# Altium schematic sheet BeagleBone_RF_Cape_Rev_A2_Host Inf.SchDoc: RF Adaptor Cape
size A4; Date: Not shown in title block; ApprovedBy: Not shown in title block; CheckedBy: Not shown in title block; Author: Not shown in title block; CompanyName: Not shown in title block; DrawnBy: Grant Smith; Engineer: Grant Smith; Organization: Texas Instruments; Address1: Not shown in title block; Address2: Not shown in title block; Address3: Not shown in title block; Address4: Not shown in title block; DocumentNumber: 2; Revision: 0.1; SheetNumber: 2; SheetTotal: 3; PRJ Title: RF Cape; CurrentTime: Not shown in title block; CurrentDate: Not shown in title block; Time: Not shown in title block; DocumentFullPathAndName: Not shown in title block; DocumentName: Not shown in title block; ModifiedDate: Not shown in title block; ImagePath: Not shown in title block; ProjectName: RF Cape for Beaglebone
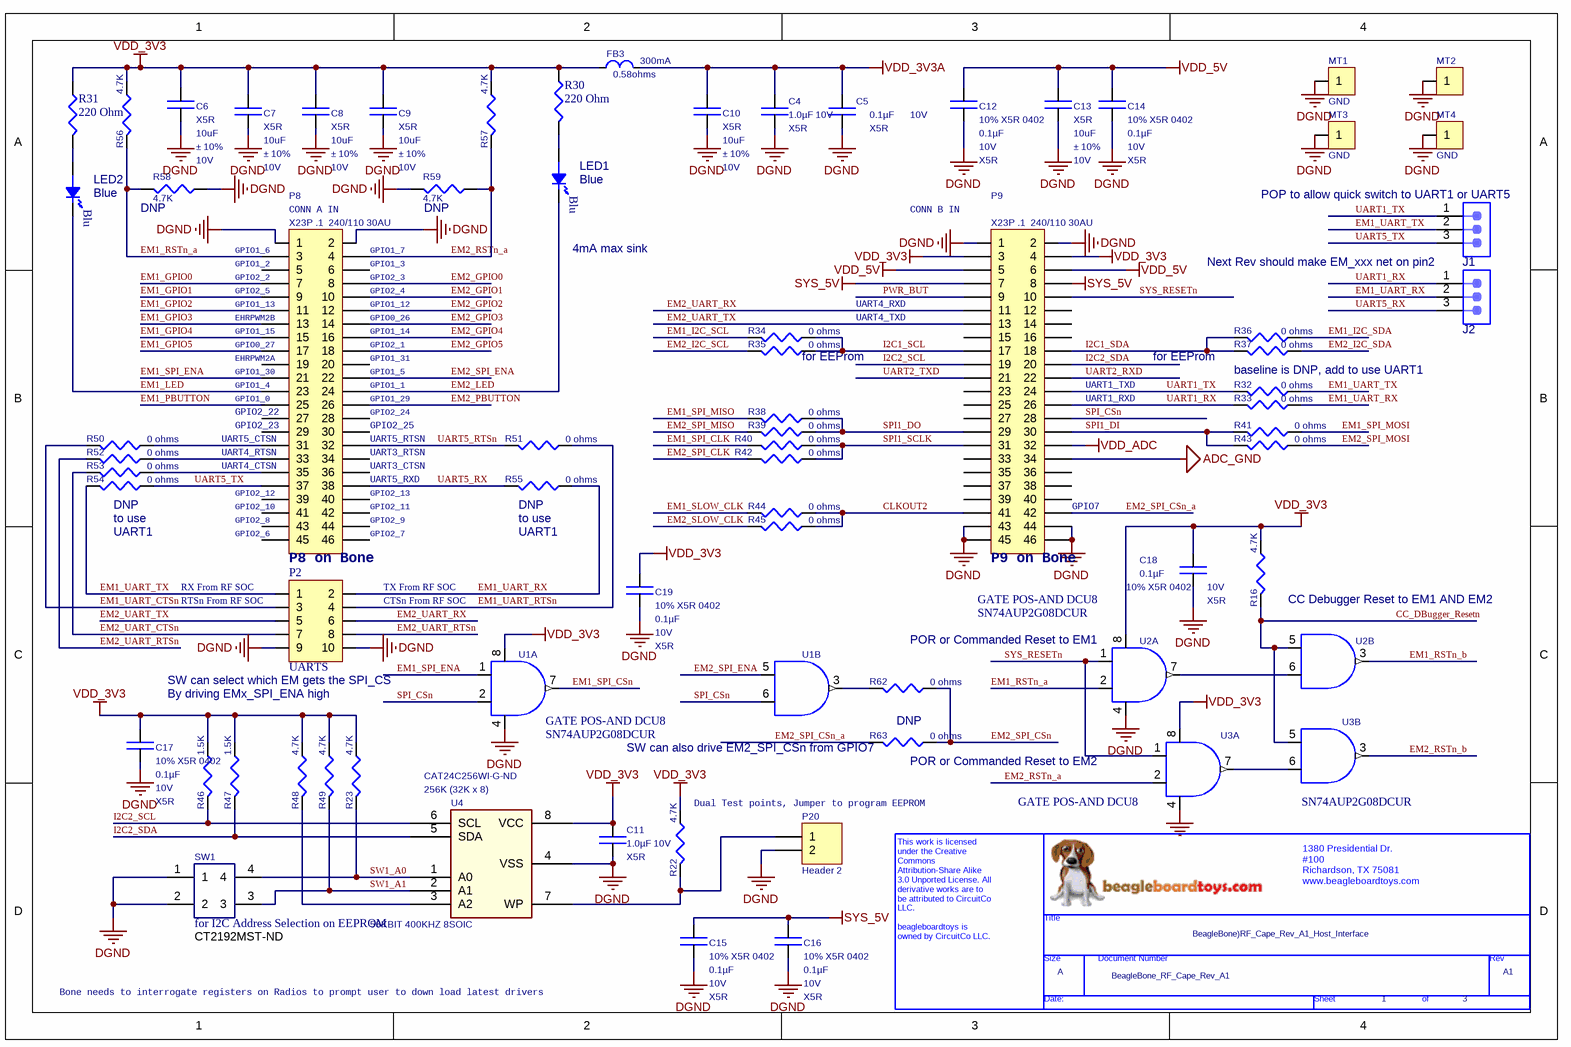
[diagram p0: BeagleBone_RF_Cape_Rev_A2_Host Inf.SchDoc]

## Parts
*?  Page Count: 3  Page Number: 1  Page Size: A  Title: BeagleBone)RF_Cape_Rev_A1_Host_Interface  RevCode: A1  Doc: BeagleBone_RF_Cape_Rev_A1  (hidden comment: BBT_OPENSOURCE)  (graphical)
C4  Capacitance: 1.0µF  Voltage - Rated: 10V  Temperature Coefficient: X5R  [CC0402]  (hidden comment: 10% X5R 0402)
C5  Capacitance: 0.1µF  Voltage - Rated: 10V  Temperature Coefficient: X5R  [CC0402]  (hidden comment: 10% X5R 0402)
C6  Dielectric Characteristic: X5R  Capacitance: 10uF  Capacitance Tolerance: ± 10%  Voltage Rating: 10V  [CC0805]  (hidden comment: 10V, X5R, 0805)
C7  Dielectric Characteristic: X5R  Capacitance: 10uF  Capacitance Tolerance: ± 10%  Voltage Rating: 10V  [CC0805]  (hidden comment: 10V, X5R, 0805)
C8  Dielectric Characteristic: X5R  Capacitance: 10uF  Capacitance Tolerance: ± 10%  Voltage Rating: 10V  [CC0805]  (hidden comment: 10V, X5R, 0805)
C9  Dielectric Characteristic: X5R  Capacitance: 10uF  Capacitance Tolerance: ± 10%  Voltage Rating: 10V  [CC0805]  (hidden comment: 10V, X5R, 0805)
C10  Dielectric Characteristic: X5R  Capacitance: 10uF  Capacitance Tolerance: ± 10%  Voltage Rating: 10V  [CC0805]  (hidden comment: 10V, X5R, 0805)
C11  Capacitance: 1.0µF  Voltage - Rated: 10V  Temperature Coefficient: X5R  [CC0402]  (hidden comment: 10% X5R 0402)
C12  10% X5R 0402  Capacitance: 0.1µF  Voltage - Rated: 10V  Temperature Coefficient: X5R  [CC0402]
C13  Dielectric Characteristic: X5R  Capacitance: 10uF  Capacitance Tolerance: ± 10%  Voltage Rating: 10V  [CC0805]  (hidden comment: 10V, X5R, 0805)
C14  10% X5R 0402  Capacitance: 0.1µF  Voltage - Rated: 10V  Temperature Coefficient: X5R  [CC0402]
C15  10% X5R 0402  Capacitance: 0.1µF  Voltage - Rated: 10V  Temperature Coefficient: X5R  [CC0402]
C16  10% X5R 0402  Capacitance: 0.1µF  Voltage - Rated: 10V  Temperature Coefficient: X5R  [CC0402]
C17  10% X5R 0402  Capacitance: 0.1µF  Voltage - Rated: 10V  Temperature Coefficient: X5R  [CC0402]
C18  10% X5R 0402  Capacitance: 0.1µF  Voltage - Rated: 10V  Temperature Coefficient: X5R  [CC0402]
C19  10% X5R 0402  Capacitance: 0.1µF  Voltage - Rated: 10V  Temperature Coefficient: X5R  [CC0402]
FB3  DC Resistance Max: 0.58ohms  DC Current Rating: 300mA  [SMT IND 0402]  (hidden comment: 0402, 580mOHM, 300mA)
J1  PBC03SAAN  [PBC03SAAN]  (value not drawn)
J2  PBC03SAAN  [PBC03SAAN]  (value not drawn)
LED1  Blue  [LED-0603]
LED2  Blue  [LED-0603]
MT1  GND  [MTGH200C125D_PL]
MT2  GND  [MTGH200C125D_PL]  (value not drawn)
MT3  GND  [MTGH200C125D_PL]
MT4  GND  [MTGH200C125D_PL]
P2  UARTS  [HEADER10P]
P8  X23P .1  240/110 30AU  [HEADER23X2 - BOT_MOUNT]
P9  X23P .1  240/110 30AU  [HEADER23X2 - BOT_MOUNT]
P20  Header 2  [HDR1X2]
R16  Resistance (Ohms): 4.7K  [RESC0402]  (hidden comment: 1/10W 1% 0402 SMD)
R22  Resistance (Ohms): 4.7K  [RESC0402]  (hidden comment: 1/10W 1% 0402 SMD)
R23  Resistance (Ohms): 4.7K  [RESC0402]  (hidden comment: 1/10W 1% 0402 SMD)
R30  Resistance (Ohms): 220 Ohm  [RESC0402]  (hidden comment: 1/10W 1% 0402 SMD)
R31  Resistance (Ohms): 220 Ohm  [RESC0402]  (hidden comment: 1/10W 1% 0402 SMD)
R32  Resistance (Ohms): 0 ohms  [RESC0402]  (hidden comment: 0402 Chip Res 5%)
R33  Resistance (Ohms): 0 ohms  [RESC0402]  (hidden comment: 0402 Chip Res 5%)
R34  Resistance (Ohms): 0 ohms  [RESC0402]  (hidden comment: 0402 Chip Res 5%)
R35  Resistance (Ohms): 0 ohms  [RESC0402]  (hidden comment: 0402 Chip Res 5%)
R36  Resistance (Ohms): 0 ohms  [RESC0402]  (hidden comment: 0402 Chip Res 5%)
R37  Resistance (Ohms): 0 ohms  [RESC0402]  (hidden comment: 0402 Chip Res 5%)
R38  Resistance (Ohms): 0 ohms  [RESC0402]  (hidden comment: 0402 Chip Res 5%)
R39  Resistance (Ohms): 0 ohms  [RESC0402]  (hidden comment: 0402 Chip Res 5%)
R40  Resistance (Ohms): 0 ohms  [RESC0402]  (hidden comment: 0402 Chip Res 5%)
R41  Resistance (Ohms): 0 ohms  [RESC0402]  (hidden comment: 0402 Chip Res 5%)
R42  Resistance (Ohms): 0 ohms  [RESC0402]  (hidden comment: 0402 Chip Res 5%)
R43  Resistance (Ohms): 0 ohms  [RESC0402]  (hidden comment: 0402 Chip Res 5%)
R44  Resistance (Ohms): 0 ohms  [RESC0402]  (hidden comment: 0402 Chip Res 5%)
R45  Resistance (Ohms): 0 ohms  [RESC0402]  (hidden comment: 0402 Chip Res 5%)
R46  Resistance (Ohms): 1.5K  [RESC0402]  (hidden comment: 1/10W 1% 0402 SMD)
R47  Resistance (Ohms): 1.5K  [RESC0402]  (hidden comment: 1/10W 1% 0402 SMD)
R48  Resistance (Ohms): 4.7K  [RESC0402]  (hidden comment: 1/10W 1% 0402 SMD)
R49  Resistance (Ohms): 4.7K  [RESC0402]  (hidden comment: 1/10W 1% 0402 SMD)
R50  Resistance (Ohms): 0 ohms  [RESC0402]  (hidden comment: 0402 Chip Res 5%)
R51  Resistance (Ohms): 0 ohms  [RESC0402]  (hidden comment: 0402 Chip Res 5%)
R52  Resistance (Ohms): 0 ohms  [RESC0402]  (hidden comment: 0402 Chip Res 5%)
R53  Resistance (Ohms): 0 ohms  [RESC0402]  (hidden comment: 0402 Chip Res 5%)
R54  Resistance (Ohms): 0 ohms  [RESC0402]  (hidden comment: 0402 Chip Res 5%)
R55  Resistance (Ohms): 0 ohms  [RESC0402]  (hidden comment: 0402 Chip Res 5%)
R56  Resistance (Ohms): 4.7K  [RESC0402]  (hidden comment: 1/10W 1% 0402 SMD)
R57  Resistance (Ohms): 4.7K  [RESC0402]  (hidden comment: 1/10W 1% 0402 SMD)
R58  Resistance (Ohms): 4.7K  [RESC0402]  (hidden comment: 1/10W 1% 0402 SMD)
R59  Resistance (Ohms): 4.7K  [RESC0402]  (hidden comment: 1/10W 1% 0402 SMD)
R62  Resistance (Ohms): 0 ohms  [RESC0402]  (hidden comment: 0402 Chip Res 5%)
R63  Resistance (Ohms): 0 ohms  [RESC0402]  (hidden comment: 0402 Chip Res 5%)
SW1  for I2C Address Selection on EEPROM  Supplier Part Number 1: CT2192MST-ND  [SM_CRY_SCC18]
U1  GATE POS-AND DCU8  Manufacturer Part Number: SN74AUP2G08DCUR  [DCU-8]  (parts A,B of 2)
U2  GATE POS-AND DCU8  Manufacturer Part Number: SN74AUP2G08DCUR  [DCU-8]  (parts A,B of 2)
U3  GATE POS-AND DCU8  Manufacturer Part Number: SN74AUP2G08DCUR  [DCU-8]  (parts A,B of 2)
U4  56KBIT 400KHZ 8SOIC  Memory Size: 256K (32K x 8)  Supplier Part Number 1: CAT24C256WI-G-ND  [SO8]

## Nets
ADC_GND: P9.34
DGND: C4.2 C5.2 C6.2 C7.2 C8.2 C9.2 C10.2 C11.2 C12.2 C13.2 C14.2 C15.2 C16.2 C17.2 C18.2 C19.2 MT1.1 MT2.1 MT3.1 MT4.1 P2.9 P2.10 P8.1 P8.2 P9.1 P9.2 P9.43 P9.44 P9.45 P9.46 P20.2 R58.1 R59.2 SW1.1 SW1.2 U1.4(GND) U2.4(GND) U3.4(GND) U4.4(VSS)
SYS_5V: C15.1 C16.1 P9.7 P9.8
VDD_3V3: C6.1 C7.1 C8.1 C9.1 C11.1 C17.1 C18.1 C19.1 FB3.2 P9.3 P9.4 R16.1 R22.1 R23.1 R30.1 R31.1 R46.1 R47.1 R48.1 R49.1 R56.1 R57.1 U1.8(VCC) U2.8(VCC) U3.8(VCC) U4.8(VCC)
VDD_3V3A: C4.1 C5.1 C10.1 FB3.1
VDD_5V: C12.1 C13.1 C14.1 P9.5 P9.6
VDD_ADC: P9.32
CC_DBugger_Resetn: R16.2 U2.5(2A) U3.5(2A)
CLKOUT2: P9.41 R44.1 R45.1
EM1_GPIO0: P8.7
EM1_GPIO1: P8.9
EM1_GPIO2: P8.11
EM1_GPIO3: P8.13
EM1_GPIO4: P8.15
EM1_GPIO5: P8.17
EM1_I2C_SCL: R34.2
EM1_I2C_SDA: R36.1
EM1_LED: LED2.K(CATHODE) P8.23
EM1_PBUTTON: P8.25
EM1_RSTn_a: P8.3 R56.2 R58.2 U2.2(2B)
EM1_RSTn_b: U2.3(2Y)
EM1_SLOW_CLK: R44.2
EM1_SPI_CLK: R40.2
EM1_SPI_CSn: U1.7(2Y)
EM1_SPI_ENA: P8.21 U1.1(2A)
EM1_SPI_MISO: R38.2
EM1_SPI_MOSI: R41.1
EM1_UART_CTSn: P2.3 R50.2
EM1_UART_RTSn: P2.4 R51.1
EM1_UART_RX: J2.2 P2.2 R33.1 R55.1
EM1_UART_TX: J1.2 P2.1 R32.1 R54.2
EM2_GPIO0: P8.8
EM2_GPIO1: P8.10
EM2_GPIO2: P8.12
EM2_GPIO3: P8.14
EM2_GPIO4: P8.16
EM2_GPIO5: P8.18
EM2_I2C_SCL: R35.2
EM2_I2C_SDA: R37.1
EM2_LED: LED1.K(CATHODE) P8.24
EM2_PBUTTON: P8.26
EM2_RSTn_a: P8.4 R57.2 R59.1 U3.2(2B)
EM2_RSTn_b: U3.3(2Y)
EM2_SLOW_CLK: R45.2
EM2_SPI_CLK: R42.2
EM2_SPI_CSn: R62.1 R63.1
EM2_SPI_CSn_a: P9.42 R63.2
EM2_SPI_ENA: P8.22 U1.5(2A)
EM2_SPI_MISO: R39.2
EM2_SPI_MOSI: R43.1
EM2_UART_CTSn: P2.7 R53.2
EM2_UART_RTSn: P2.8 R52.2
EM2_UART_RX: P2.6 P9.11
EM2_UART_TX: P2.5 P9.13
I2C1_SCL: P9.17 R34.1 R35.1
I2C1_SDA: P9.18 R36.2 R37.2
I2C2_SCL: P9.19 R46.2 U4.6(SCL)
I2C2_SDA: P9.20 R47.2 U4.5(SDA)
PWR_BUT: P9.9
SPI1_DI: P9.30 R41.2 R43.2
SPI1_DO: P9.29 R38.1 R39.1
SPI1_SCLK: P9.31 R40.1 R42.1
SPI_CSn: P9.28 U1.2(2B) U1.6(2B)
SW1_A0: R23.2 SW1.4 U4.1(A0)
SW1_A1: R49.2 SW1.3 U4.2(A1)
SYS_RESETn: P9.10 U2.1(2A) U3.1(2A)
UART1_RX: J2.1 P9.26 R33.2
UART1_TX: J1.1 P9.24 R32.2
UART2_RXD: P9.22
UART2_TXD: P9.21
UART5_RTSn: P8.32 R51.2
UART5_RX: J2.3 P8.38 R55.2
UART5_TX: J1.3 P8.37 R54.1
NetLED1_A: LED1.A(ANODE) R30.2
NetLED2_A: LED2.A(ANODE) R31.2
NetP8_31: P8.31 R50.1
NetP8_33: P8.33 R52.1
NetP8_35: P8.35 R53.1
NetP20_1: P20.1 R22.2 U4.7(WP)
NetR48_2: R48.2 U4.3(A2)
NetR62_2: R62.2 U1.3(2Y)
NetU2_6: U2.6(2B) U2.7(2Y)
NetU3_6: U3.6(2B) U3.7(2Y)

Not connected (* = marked no-connect by the designer): P8 5 6 19 20 27 28 29 30 34 36 39 40 41 42 43 44 45 46; P9 12 14 15 16 23 25 27 33 35 36 37 38 39 40

## Notes on the sheet
- (near R58) DNP
- (near P8) GPIO1_6
- (near P8) CONN A IN
- (near P8) GPIO1_7
- (near R59) DNP
- 4mA max sink
- (near P9) CONN B IN
- (near J1) POP to allow quick switch to UART1 or UART5
- (near P8) GPIO1_2
- (near P8) GPIO2_2
- (near P8) GPIO2_5
- (near P8) GPIO1_13
- (near P8) EHRPWM2B
- (near P8) GPIO2_3
- (near P8) GPIO2_4
- (near P8) GPIO1_12
- (near P8) GPIO0_26
- (near P8) GPIO1_3
- UART4_RXD
- UART4_TXD
- Next Rev should make EM_xxx net on pin2
- (near P8) GPIO1_15
- (near P8) GPIO0_27
- (near P8) EHRPWM2A
- (near P8) GPIO1_30
- (near P8) GPIO1_4
- (near P8) GPIO1_14
- (near P8) GPIO2_1
- (near P8) GPIO1_31
- (near P8) GPIO1_5
- (near P8) GPIO1_1
- (near R35) for EEProm
- (near P9) UART1_TXD
- for EEProm
- baseline is DNP, add to use UART1
- (near P8) UART5_CTSN
- (near P8) UART4_RTSN
- (near P8) GPIO2_22
- (near P8) GPIO2_23
- (near P8) GPIO1_0
- (near P8) GPIO2_25
- (near P8) GPIO1_29
- (near P8) UART5_RTSN
- (near P8) UART3_RTSN
- (near P8) GPIO2_24
- (near P9) UART1_RXD
- (near R54) DNP
- to use
- (near P8) UART4_CTSN
- (near P8) GPIO2_12
- (near P8) GPIO2_10
- (near P8) GPIO2_8
- (near P8) UART5_RXD
- (near P8) GPIO2_9
- (near P8) GPIO2_11
- (near P8) GPIO2_13
- (near P8) UART3_CTSN
- (near R55) DNP
- (near R55) to use
- (near P9) GPIO7
- UART1
- RX From RF SOC
- (near P8) GPIO2_6
- (near P8) P8 on Bone
- (near P8) GPIO2_7
- TX From RF SOC
- (near R55) UART1
- (near P9) P9 on Bone
- (near P2) RTSn From RF SOC
- CTSn From RF SOC
- POR or Commanded Reset to EM1
- CC Debugger Reset to EM1 AND EM2
- (near P2) SW can select which EM gets the SPI_CS
- By driving EMx_SPI_ENA high
- (near R63) DNP
- (near R63) SW can also drive EM2_SPI_CSn from GPIO7
- (near R63) POR or Commanded Reset to EM2
- Dual Test points, Jumper to program EEPROM
- Bone needs to interrogate registers on Radios to prompt user to down load latest drivers
- (in symbol BBT_OPENSOURCE) 1380 Presidential Dr. / #100 / Richardson, TX 75081 / www.beagleboardtoys.com /; Title; Size; Document Number; Rev; Date:; Sheet; of; This work is licensed / under the Creative / Commons / Attribution-Share Alike / 3.0 Unported License. All / derivative works are to / be attributed to CircuitCo / LLC. / beagleboardtoys is / owned by CircuitCo LLC. /
- (in symbol LED-BLU-0603) Blu

## Library data of the parts
*? = BBT_OPENSOURCE: OrgName: BBT; Page Create Date: July 16 2012
C4 C11 = LMK105BJ105KV-F: CAP CER 1UF 10V 10% X5R 0402; Manufacturer: Taiyo Yuden; Supplier 1: Digi-Key; RoHS: RoHS Compliant; Category: Capacitors; Stock 1: 310000; Pricing 1: 10000=0.00798, 20000=0.0076, 30000=0.00722, 50000=0.00646 (USD); Tolerance: ±10%; Mounting Type: Surface Mount, MLCC; Operating Temperature: -55°C ~ 85°C; Applications: General Purpose; Ratings: -; Package / Case: 0402 (1005 Metric); Size / Dimension: 0.039" L x 0.020" W (1.00mm x 0.50mm); Height - Seated (Max): -; Thickness (Max): 0.022" (0.55mm); Lead Spacing: -; Features: -; Packaging: Tape & Reel (TR); Lead Style: -; ComponentLink1URL: http://www.yuden.co.jp/productdata/catalog/en/mlcc01_e.pdf; ComponentLink1Description: http://www.yuden.co.jp/productdata/catalog/en/mlcc01_e.pdf; Supplier Part Number 1: 587-1454-2-ND; Manufacturer Part Number: LMK105BJ105KV-F
C5 C12 C14-C19 = LMK105BJ104KV-F: CAP CER 0.1UF 10V 10% X5R 0402; Manufacturer: Taiyo Yuden; Supplier 1: Digi-Key; RoHS: RoHS Compliant; Category: Capacitors; Stock 1: 3218784; Pricing 1: 1=0.04, 10=0.025, 50=0.012, 100=0.009, 250=0.00652, 500=0.0048, 1000=0.00325, 5000=0.0025 (USD); Tolerance: ±10%; Mounting Type: Surface Mount, MLCC; Operating Temperature: -55°C ~ 85°C; Applications: General Purpose; Ratings: -; Package / Case: 0402 (1005 Metric); Size / Dimension: 0.039" L x 0.020" W (1.00mm x 0.50mm); Height - Seated (Max): -; Thickness (Max): 0.022" (0.55mm); Lead Spacing: -; Features: -; Packaging: Digi-Reel®; Lead Style: -; ComponentLink1URL: http://www.yuden.co.jp/productdata/catalog/en/mlcc01_e.pdf; ComponentLink1Description: http://www.yuden.co.jp/productdata/catalog/en/mlcc01_e.pdf; Supplier Part Number 1: 587-1227-6-ND; Manufacturer Part Number: LMK105BJ104KV-F
C6-C10 C13 = C0805C106K8PACTU: CAP CER10UF, 10V, X5R, 0805; Manufacturer: KEMET; Description: KEMET - C0805C106K8PACTU - CAPACITOR CERAMIC, 10UF, 10V, X5R, 0805; Capacitor Case Style: 0805; Capacitor Mounting: SMD; Supplier 1: Newark; RoHS: YES; Stock 1: 144494; Pricing 1: 1=0.25, 10=0.25, 100=0.24, 500=0.234, 1000=0.2, 2500=0.183, 5000=0.162, 10000=0.157 (USD); Operating Temperature Range: -55°C to +85; ComponentLink1URL: http://www.kemet.com/kemet/web/homepage/kechome.nsf/file/Commercial Ceramic Chips X5R Dielectric/$file/KEM_C1006_X5R_SMD.pdf; ComponentLink1Description: http://www.kemet.com/kemet/web/homepage/kechome.nsf/file/Commercial Ceramic Chips X5R Dielectric/$file/KEM_C1006_X5R_SMD.pdf; ComponentLink2URL: http://www.farnell.com/cad/1455916.zip; ComponentLink2Description: http://www.farnell.com/cad/1455916.zip; ComponentLink3URL: http://www.semtech.com.hk/Transistor/Packing/Tape%20and%20Reel%20Specifications%20and%20Packaging%20Specifications.pdf; ComponentLink3Description: http://www.semtech.com.hk/Transistor/Packing/Tape%20and%20Reel%20Specifications%20and%20Packaging%20Specifications.pdf; ComponentLink4URL: http://www.kemet.com/kemet/web/homepage/kechome.nsf/file/Commercial%20Ceramic%20Chips%20X5R%20Dielectric/$file/F3102_X5R.pdf; ComponentLink4Description: http://www.kemet.com/kemet/web/homepage/kechome.nsf/file/Commercial%20Ceramic%20Chips%20X5R%20Dielectric/$file/F3102_X5R.pdf; Supplier Part Number 1: 70K9138; Manufacturer Part Number: C0805C106K8PACTU
FB3 = BK1005HS102-T: FERRITE BEAD, 0402, 580mOHM, 300mA; Manufacturer: TAIYO YUDEN; Description: TAIYO YUDEN - BK1005HS102-T - FERRITE BEAD, 0402, 580mOHM, 300mA; Impedance: 1; Ferrite Grade: HS; Ferrite Mounting: SMD; Ferrite Case Style: 0402 / 1005; Supplier 1: Newark; RoHS: YES; Stock 1: 9870; Pricing 1: 1=0.328, 10=0.219, 50=0.113, 100=0.088, 250=0.063, 500=0.045, 1000=0.033, 4000=0.024 (USD); Series: LF BK; ComponentLink1URL: http://www.yuden.co.jp/ut/product/category/emisuppression/BK1005HS102-T.pdf; ComponentLink1Description: http://www.yuden.co.jp/ut/product/category/emisuppression/BK1005HS102-T.pdf; ComponentLink2URL: http://www.yuden.co.jp/us/product/pdf_html/pdf/E)Chip%20Beads.pdf; ComponentLink2Description: http://www.yuden.co.jp/us/product/pdf_html/pdf/E)Chip%20Beads.pdf; Supplier Part Number 1: 87K3443; Manufacturer Part Number: BK1005HS102-T
J1 J2 = PBC03SAAN: Header, TH, 100mil, 1x3, Gold plated, 230 mil above insulator; Manufacturer: Sullins Connector Solutions; Alternate Manufacturer: Any; Alternate PartNumber: Equivalent; U/M: EA; RoHS: Y; DigiKeyPartNumber: S1011E-03-ND; CompType: Header; Value: 1x3; SymbolVersion: 2008-06-30; PartNumber: PBC03SAAN; PackageReference: PBC03SAAN; ComponentLink1Description: Datasheet Link; ComponentLink1URL: http://www.sullinscorp.com/catalogs/77_Page78-79_HEADER_.100_2.54mm_MALE_BREAKAWAY.pdf; MountType: TH; ClassName: Header; Publisher: Texas Instruments; LatestRevisionDate: 2012-07-13; LatestRevisionNote: Changed publisher; Supplier 1: Digi-Key; Supplier Part Number 1: S1011E-03-ND
LED1 LED2 = LED-BLU-0603: SMT LED 0603; Mfg. Part Number: LNJ926W8CR; Desc.: LED BLUE 0603; Mfg.: Panasonic; Supplier 1: Digi-Key; Supplier Part Number 1: P13484CT-ND
MT1-MT4 = MT_1P: 1P .125DIA; Manufacturer: DNP; Desc.: MOUNTING HOLE 0.125Dia; Description: CONN HEADER VERT .125 1POS; Connector Type: Header, Unshrouded; Number of Positions: 1; Number of Positions Loaded: All; Row Spacing: 0; Supplier 1: Digi-Key; Supplier Part Number 1: A26541-ND; RoHS: RoHS Compliant; Category: Connectors, Interconnects; Stock 1: 6144; Pricing 1: 1=0.58, 10=0.541, 25=0.4868, 50=0.4328, 100=0.4148, 250=0.37876, 500=0.36072, 1000=0.29759, 2500=0.27054 (USD); Contact Type: Male Pin; Pitch: .125Dia; Number of Rows: 1; Contact Mating Length: 0.318" (8.08mm); Mounting Type: Through Hole; Termination: Solder; Fastening Type: -; Features: -; Contact Finish: Gold; Contact Finish Thickness: 15µin (0.38µm); Color: Black; Packaging: Bulk; ComponentLink1URL: http://documents.tycoelectronics.com/commerce/DocumentDelivery/DDEController?Action=srchrtrv&DocNm=87224&DocType=CD&DocLang=EN; ComponentLink1Description: http://documents.tycoelectronics.com/commerce/DocumentDelivery/DDEController?Action=srchrtrv&DocNm=87224&DocType=CD&DocLang=EN; Manufacturer Part Number: DNP
P2 = SMT Header 5x2: SMT Header, 10-Pin, .050LS Dual row; Mfg. Part Number: GRPB052VWQS-RC; Manufacturer: Sullins Connector Solutions; Desc.: SMT Header .050 Lead spacing SMT; Mfg.: Sullins; Description: CONN HEADER .050" 10PS DL SMD AU; Connector Type: Header, Unshrouded; Number of Positions: 10; Number of Positions Loaded: All; Pitch: 0.050" (1.27mm); Supplier 1: Digi-Key; Supplier Part Number 1: S9012E-05-ND; RoHS: RoHS Compliant; Category: Connectors, Interconnects; Stock 1: 4993; Pricing 1: 1=1.08, 10=0.899, 50=0.7492, 100=0.666, 250=0.58276, 500=0.5328, 1000=0.48285, 2500=0.4329, 5000=0.42458 (USD); Contact Type: Male Pin; Number of Rows: 2; Row Spacing: 0.050" (1.27mm); Contact Mating Length: 0.118" (3.00mm); Mounting Type: Surface Mount; Termination: Solder; Fastening Type: -; Features: -; Contact Finish: Gold; Contact Finish Thickness: Flash; Color: -; Packaging: Bulk; ComponentLink1URL: http://media.digikey.com/pdf/Data%20Sheets/Sullins%20PDFs/GRPB_%20_2VWQS-RC%2010958-C.pdf; ComponentLink1Description: http://media.digikey.com/pdf/Data%20Sheets/Sullins%20PDFs/GRPB_%20_2VWQS-RC%2010958-C.pdf; Manufacturer Part Number: GRPB052VWQS-RC
P8 P9 = 10-89-7460: Headers & Wire Housings HDR VT 2X23P .1  240/110 30AU; Manufacturer: Molex; Current Rating: 3 A; Mounting Angle: Vertical; Voltage Rating: 250 V; Pitch: 2.54 mm; Number of Positions / Contacts: 46; Supplier 1: Mouser; RoHS: RoHS Compliant; Category: Headers & Wire Housings; Stock 1: 0; Pricing 1: 890=3.47, 1000=3.29 (AUD); Contact Plating: Gold; Housing Material: Thermoplastic, High Temperature; Number of Rows: 2; Packaging: Bag; Series: C-Grid Series; Termination Style: Solder; Contact Material: Brass; Mounting Style: Through Hole; Product Category: C-Grid Connectors; Product Type: Headers - Breakaway; Standard Pack Qty: 375; RoHS - Mouser: Y; Minimum Order Quantity: 890; Reeling: False; ComponentLink1URL: http://www.molex.com/webdocs/datasheets/pdf/en-us/0010897460_PCB_HEADERS.pdf; ComponentLink1Description: http://www.molex.com/webdocs/datasheets/pdf/en-us/0010897460_PCB_HEADERS.pdf; Supplier Part Number 1: 538-10-89-7460; Manufacturer Part Number: 10-89-7460
P20 = Header 2: Header, 2-Pin; LatestRevisionDate: 17-Jul-2002; LatestRevisionNote: Re-released for DXP Platform.; Publisher: Altium Limited
R16 R22 R23 R48 R49 R56-R59 = ERJ-2RKF4701X: RES 4.70K OHM 1/10W 1% 0402 SMD; Manufacturer: Panasonic - ECG; Power (Watts): 0.1W, 1/10W; Temperature Coefficient: ±100ppm/°C; Supplier 1: Digi-Key; RoHS: RoHS Compliant; Category: Resistors; Stock 1: 1996806; Pricing 1: 1=0.06, 50=0.0242, 100=0.0184, 250=0.01364, 500=0.01008, 1000=0.00672, 5000=0.00473 (USD); Composition: Thick Film; Features: -; Tolerance: ±1%; Size / Dimension: 0.039" L x 0.020" W (1.00mm x 0.50mm); Height: 0.016" (0.40mm); Number of Terminations: 2; Packaging: Cut Tape (CT); Package / Case: 0402 (1005 Metric); ComponentLink1URL: http://industrial.panasonic.com/www-cgi/jvcr13pz.cgi?E+PZ+3+AOA0002+ERJ2RKF4701X+7+WW; ComponentLink1Description: http://industrial.panasonic.com/www-cgi/jvcr13pz.cgi?E+PZ+3+AOA0002+ERJ2RKF4701X+7+WW; Supplier Part Number 1: P4.70KLCT-ND; Manufacturer Part Number: ERJ-2RKF4701X
R30 R31 = ERJ-2GEJ221X: RES 220 OHM 1/10W 1% 0402 SMD; Manufacturer: Panasonic - ECG; Power (Watts): 0.1W, 1/10W; Temperature Coefficient: ±100ppm/°C; RoHS: RoHS Compliant; Category: Resistors; Composition: Thick Film; Features: -; Tolerance: ±1%; Size / Dimension: 0.039" L x 0.020" W (1.00mm x 0.50mm); Height: 0.016" (0.40mm); Number of Terminations: 2; Packaging: Cut Tape (CT); Package / Case: 0402 (1005 Metric); ComponentLink1URL: http://industrial.panasonic.com/www-cgi/jvcr13pz.cgi?E+PZ+3+AOA0002+ERJ2RKF1501X+7+WW; ComponentLink1Description: http://industrial.panasonic.com/www-cgi/jvcr13pz.cgi?E+PZ+3+AOA0002+ERJ2RKF1501X+7+WW; Manufacturer Part Number: ERJ-2GEJ221X; Supplier 1: Digi-Key; Supplier Part Number 1: P220JCT-ND
R32-R45 R50-R55 R62 R63 = ERJ-2GE0R00X: RES 0.0 OHM 1/10W 0402 SMD; Manufacturer: Panasonic - ECG; Power (Watts): 0.1W, 1/10W; Tolerance: Jumper; Manufacturer Part Number: ERJ-2GE0R00X; Supplier 1: Digi-Key; RoHS: RoHS Compliant; Category: Resistors; Stock 1: 6266946; Pricing 1: 1=0.05, 50=0.0172, 100=0.0131, 250=0.00976, 500=0.0072, 1000=0.0048, 5000=0.00338 (USD); Composition: Thick Film; Features: -; Temperature Coefficient: -; Size / Dimension: 0.039" L x 0.020" W (1.00mm x 0.50mm); Height: 0.016" (0.40mm); Number of Terminations: 2; Packaging: Digi-Reel®; Package / Case: 0402 (1005 Metric); ComponentLink1URL: http://industrial.panasonic.com/www-cgi/jvcr13pz.cgi?E+PZ+3+AOA0001+ERJ2GE0R00X+7+WW; ComponentLink1Description: http://industrial.panasonic.com/www-cgi/jvcr13pz.cgi?E+PZ+3+AOA0001+ERJ2GE0R00X+7+WW; Supplier Part Number 1: P0.0JDKR-ND
R46 R47 = ERJ-2RKF1501X: RES 1.50K OHM 1/10W 1% 0402 SMD; Manufacturer: Panasonic - ECG; Power (Watts): 0.1W, 1/10W; Temperature Coefficient: ±100ppm/°C; Supplier 1: Digi-Key; RoHS: RoHS Compliant; Category: Resistors; Stock 1: 1107937; Pricing 1: 1=0.06, 50=0.0242, 100=0.0184, 250=0.01364, 500=0.01008, 1000=0.00672, 5000=0.00473 (USD); Composition: Thick Film; Features: -; Tolerance: ±1%; Size / Dimension: 0.039" L x 0.020" W (1.00mm x 0.50mm); Height: 0.016" (0.40mm); Number of Terminations: 2; Packaging: Cut Tape (CT); Package / Case: 0402 (1005 Metric); ComponentLink1URL: http://industrial.panasonic.com/www-cgi/jvcr13pz.cgi?E+PZ+3+AOA0002+ERJ2RKF1501X+7+WW; ComponentLink1Description: http://industrial.panasonic.com/www-cgi/jvcr13pz.cgi?E+PZ+3+AOA0002+ERJ2RKF1501X+7+WW; Supplier Part Number 1: P1.50KLCT-ND; Manufacturer Part Number: ERJ-2RKF1501X
SW1 = SW_DIP_2P: SMT 2Pos Slide Dip Switch; Manufacturer: CTS; PartNumber: 2192MST; Description: CTS - 2192MST - SWITCH, DIP, 2 POS, SPST, RECESSED; Contact Configuration: SPST; No. of Switch Positions: 2; Actuator Style: Recessed; Pitch Spacing: 2.54; Contact Current DC Max: 25; Switch Mounting: PCB; Circuitry: SPST-CO; Supplier 1: Digi-Key; RoHS: YES; Color: Black; ComponentLink1URL: http://www.farnell.com/datasheets/32975.pdf; ComponentLink1Description: http://www.farnell.com/datasheets/32975.pdf; Category: Switch
U1-U3 = IC_SN74AUP2G08_0: IC GATE POS-AND DL 2INP LP 8US8; TIIntPartnumber: 1A0249; MfrNum: SN74AUP2G08DCU; Mfr: TI; Part Number: IC_SN74AUP2G08_DCUR; Manufacturer: Texas Instruments; Vendor: Digikey; Logic Type: AND Gate; Number of Inputs: 2; Current - Output High, Low: 4mA, 4mA; Voltage - Supply: 0.8 V ~ 3.6 V; Logic Family: AUP; Number of Lines (Input / Output): 2 / 1; Number of Output Lines: 1; Supply Voltage (Max): 3.6 V; Supply Voltage (Min): 0.8 V; High Level Output Current: - 4 mA; Low Level Output Current: 4 mA; Propagation Delay Time: 26.3 ns; PartName: SN74AUP2G08; Supplier 1: Digi-Key; RoHS: RoHS Compliant; Category: Integrated Circuits (ICs); Number of Circuits: 2; Operating Temperature: -40°C ~ 85°C; Mounting Type: Surface Mount; Package / Case: 8-VFSOP (0.091", 2.30mm Width); Supplier Device Package: US8; Packaging: Tape & Reel (TR); ComponentLink1URL: http://www.ti.com/lit/ds/symlink/sn74aup2g08.pdf; ComponentLink1Description: http://www.ti.com/lit/ds/symlink/sn74aup2g08.pdf; Supplier Part Number 1: 296-32271-1-ND; Product: AND; Mounting Style: SMD/SMT; Number of Gates: 2; Number of Input Lines: 2; Maximum Operating Temperature: + 85 C; Minimum Operating Temperature: - 40 C; Product Category: Logic - Gates; RoHS - Mouser: Y; Minimum Order Quantity: 1; Reeling: True; ComponentLink2URL: http://www.ti.com/lit/gpn/sn74aup2g08; ComponentLink2Description: http://www.ti.com/lit/gpn/sn74aup2g08
U4 = CAT24C256WI-G: IC EEPROM 256KBIT 400KHZ 8SOIC; Manufacturer: ON Semiconductor; Format - Memory: EEPROMs - Serial; Interface: I²C, 2-Wire Serial; Voltage - Supply: 1.8 V ~ 5.5 V; Supplier 1: Digi-Key; RoHS: RoHS Compliant; Category: Integrated Circuits (ICs); Stock 1: 0; Pricing 1: 1=1.33, 25=1.0624, 100=0.9295, 250=0.81572, 500=0.72086, 1000=0.5691, 2500=0.53116, 5000=0.5046, 10000=0.48374 (USD); Memory Type: EEPROM; Speed: 400kHz; Operating Temperature: -40°C ~ 85°C; Package / Case: 8-SOIC (0.154", 3.90mm Width); Supplier Device Package: 8-SOICN; Packaging: Tube; ComponentLink1URL: http://www.onsemi.com/pub_link/Collateral/CAT24C256-D.PDF; ComponentLink1Description: http://www.onsemi.com/pub_link/Collateral/CAT24C256-D.PDF; Manufacturer Part Number: CAT24C256WI-G